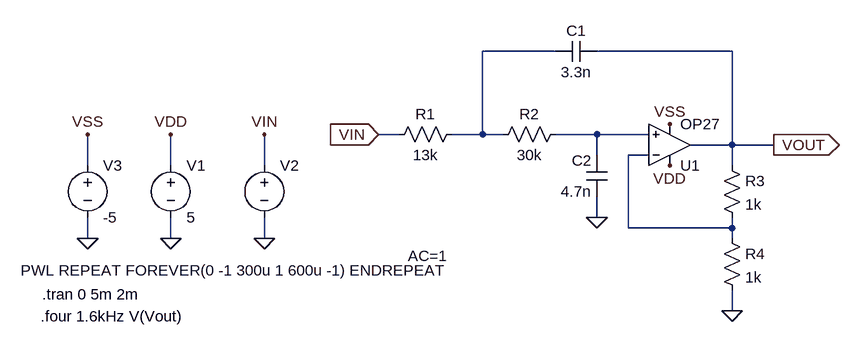
[diagram p0: schematic SallenKeyLPF.asc]
SallenKeyLPF.asc, the LTspice schematic file:
Version 4
SHEET 1 1180 680
WIRE 592 -80 480 -80
WIRE 864 -80 656 -80
WIRE 352 48 320 48
WIRE 480 48 480 -80
WIRE 480 48 432 48
WIRE 512 48 480 48
WIRE 656 48 592 48
WIRE 736 48 656 48
WIRE 864 64 864 -80
WIRE 864 64 800 64
WIRE 928 64 864 64
WIRE 656 80 656 48
WIRE 736 80 704 80
WIRE -128 96 -128 48
WIRE 0 96 0 48
WIRE 144 96 144 48
WIRE 864 96 864 64
WIRE 656 176 656 144
WIRE 704 192 704 80
WIRE 864 192 864 176
WIRE 864 192 704 192
WIRE -128 208 -128 176
WIRE 0 208 0 176
WIRE 144 208 144 176
WIRE 864 208 864 192
WIRE 864 320 864 288
FLAG 144 208 0
FLAG 0 208 0
FLAG -128 208 0
FLAG -128 48 VSS
FLAG 0 48 VDD
FLAG 144 48 VIN
FLAG 768 96 VDD
FLAG 768 32 VSS
FLAG 928 64 VOUT
IOPIN 928 64 Out
FLAG 320 48 VIN
IOPIN 320 48 In
FLAG 656 176 0
FLAG 864 320 0
SYMBOL voltage 0 80 R0
WINDOW 123 0 0 Left 2
WINDOW 39 0 0 Left 2
SYMATTR InstName V1
SYMATTR Value 5
SYMBOL voltage 144 80 R0
WINDOW 3 282 177 Right 2
WINDOW 123 282 155 Right 2
SYMATTR InstName V2
SYMATTR Value PWL REPEAT FOREVER(0 -1 300u 1 600u -1) ENDREPEAT
SYMATTR Value2 AC=1
SYMBOL voltage -128 80 R0
WINDOW 123 0 0 Left 2
WINDOW 39 0 0 Left 2
SYMATTR InstName V3
SYMATTR Value -5
SYMBOL res 448 32 R90
WINDOW 0 0 56 VBottom 2
WINDOW 3 32 56 VTop 2
SYMATTR InstName R1
SYMATTR Value 13k
SYMBOL res 608 32 R90
WINDOW 0 0 56 VBottom 2
WINDOW 3 32 56 VTop 2
SYMATTR InstName R2
SYMATTR Value 30k
SYMBOL cap 656 -96 R90
WINDOW 0 0 32 VBottom 2
WINDOW 3 32 32 VTop 2
SYMATTR InstName C1
SYMATTR Value 3.3n
SYMBOL cap 672 144 R180
WINDOW 0 24 56 Left 2
WINDOW 3 24 8 Left 2
SYMATTR InstName C2
SYMATTR Value 4.7n
SYMBOL Opamps\\OP27 768 128 M180
SYMATTR InstName U1
SYMBOL res 848 80 R0
SYMATTR InstName R3
SYMATTR Value 1k
SYMBOL res 848 192 R0
SYMATTR InstName R4
SYMATTR Value 1k
TEXT -198 294 Left 2 !.tran 0 5m 2m
TEXT -200 328 Left 2 !.four 1.6kHz V(Vout)

The netlist it stands for:
* SallenKeyLPF.asc
V1 VDD 0 5
V2 VIN 0 PWL REPEAT FOREVER(0 -1 300u 1 600u -1) ENDREPEAT AC=1
V3 VSS 0 -5
R1 N001 VIN 13k
R2 N002 N001 30k
C1 VOUT N001 3.3n
C2 0 N002 4.7n
XU1 N002 N003 VDD VSS VOUT OP27  ; pins In+ In- V+ V- OUT
R3 VOUT N003 1k
R4 N003 0 1k
.tran 0 5m 2m
.four 1.6kHz V(Vout)
.lib ADI.lib
.backanno
.end